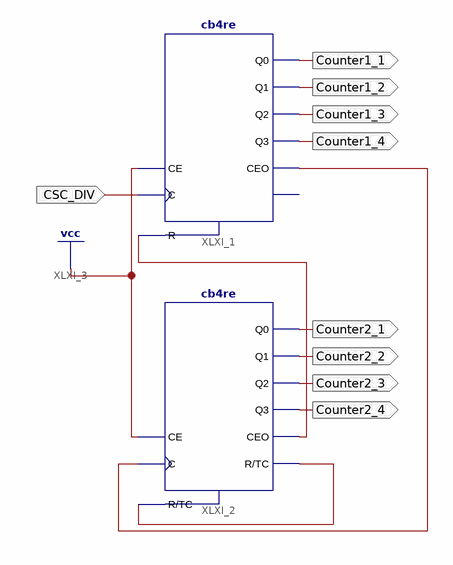
[diagram p0: schematic sheet 1]
// Xilinx ISE schematic Counter_CEOTOR.sch (spartan6) as structural Verilog: 2 symbols, 9 ports
module Counter_CEOTOR (
  input  CSC_DIV,
  output Counter1_1,
  output Counter1_2,
  output Counter1_3,
  output Counter1_4,
  output Counter2_1,
  output Counter2_2,
  output Counter2_3,
  output Counter2_4
);

  wire XLXN_18, XLXN_20, XLXN_21;

  cb4re XLXI_1 (
    .C(CSC_DIV), .CE(1'b1), .R(XLXN_21), .CEO(XLXN_18), .Q0(Counter1_1), .Q1(Counter1_2), .Q2(Counter1_3),
    .Q3(Counter1_4));  // open: TC
  cb4re XLXI_2 (
    .C(XLXN_18), .CE(1'b1), .R(XLXN_20), .CEO(XLXN_21), .Q0(Counter2_1), .Q1(Counter2_2), .Q2(Counter2_3),
    .Q3(Counter2_4), .TC(XLXN_20));
endmodule
